# EAGLE schematic SoilCape (EAGLE 7.2.0)
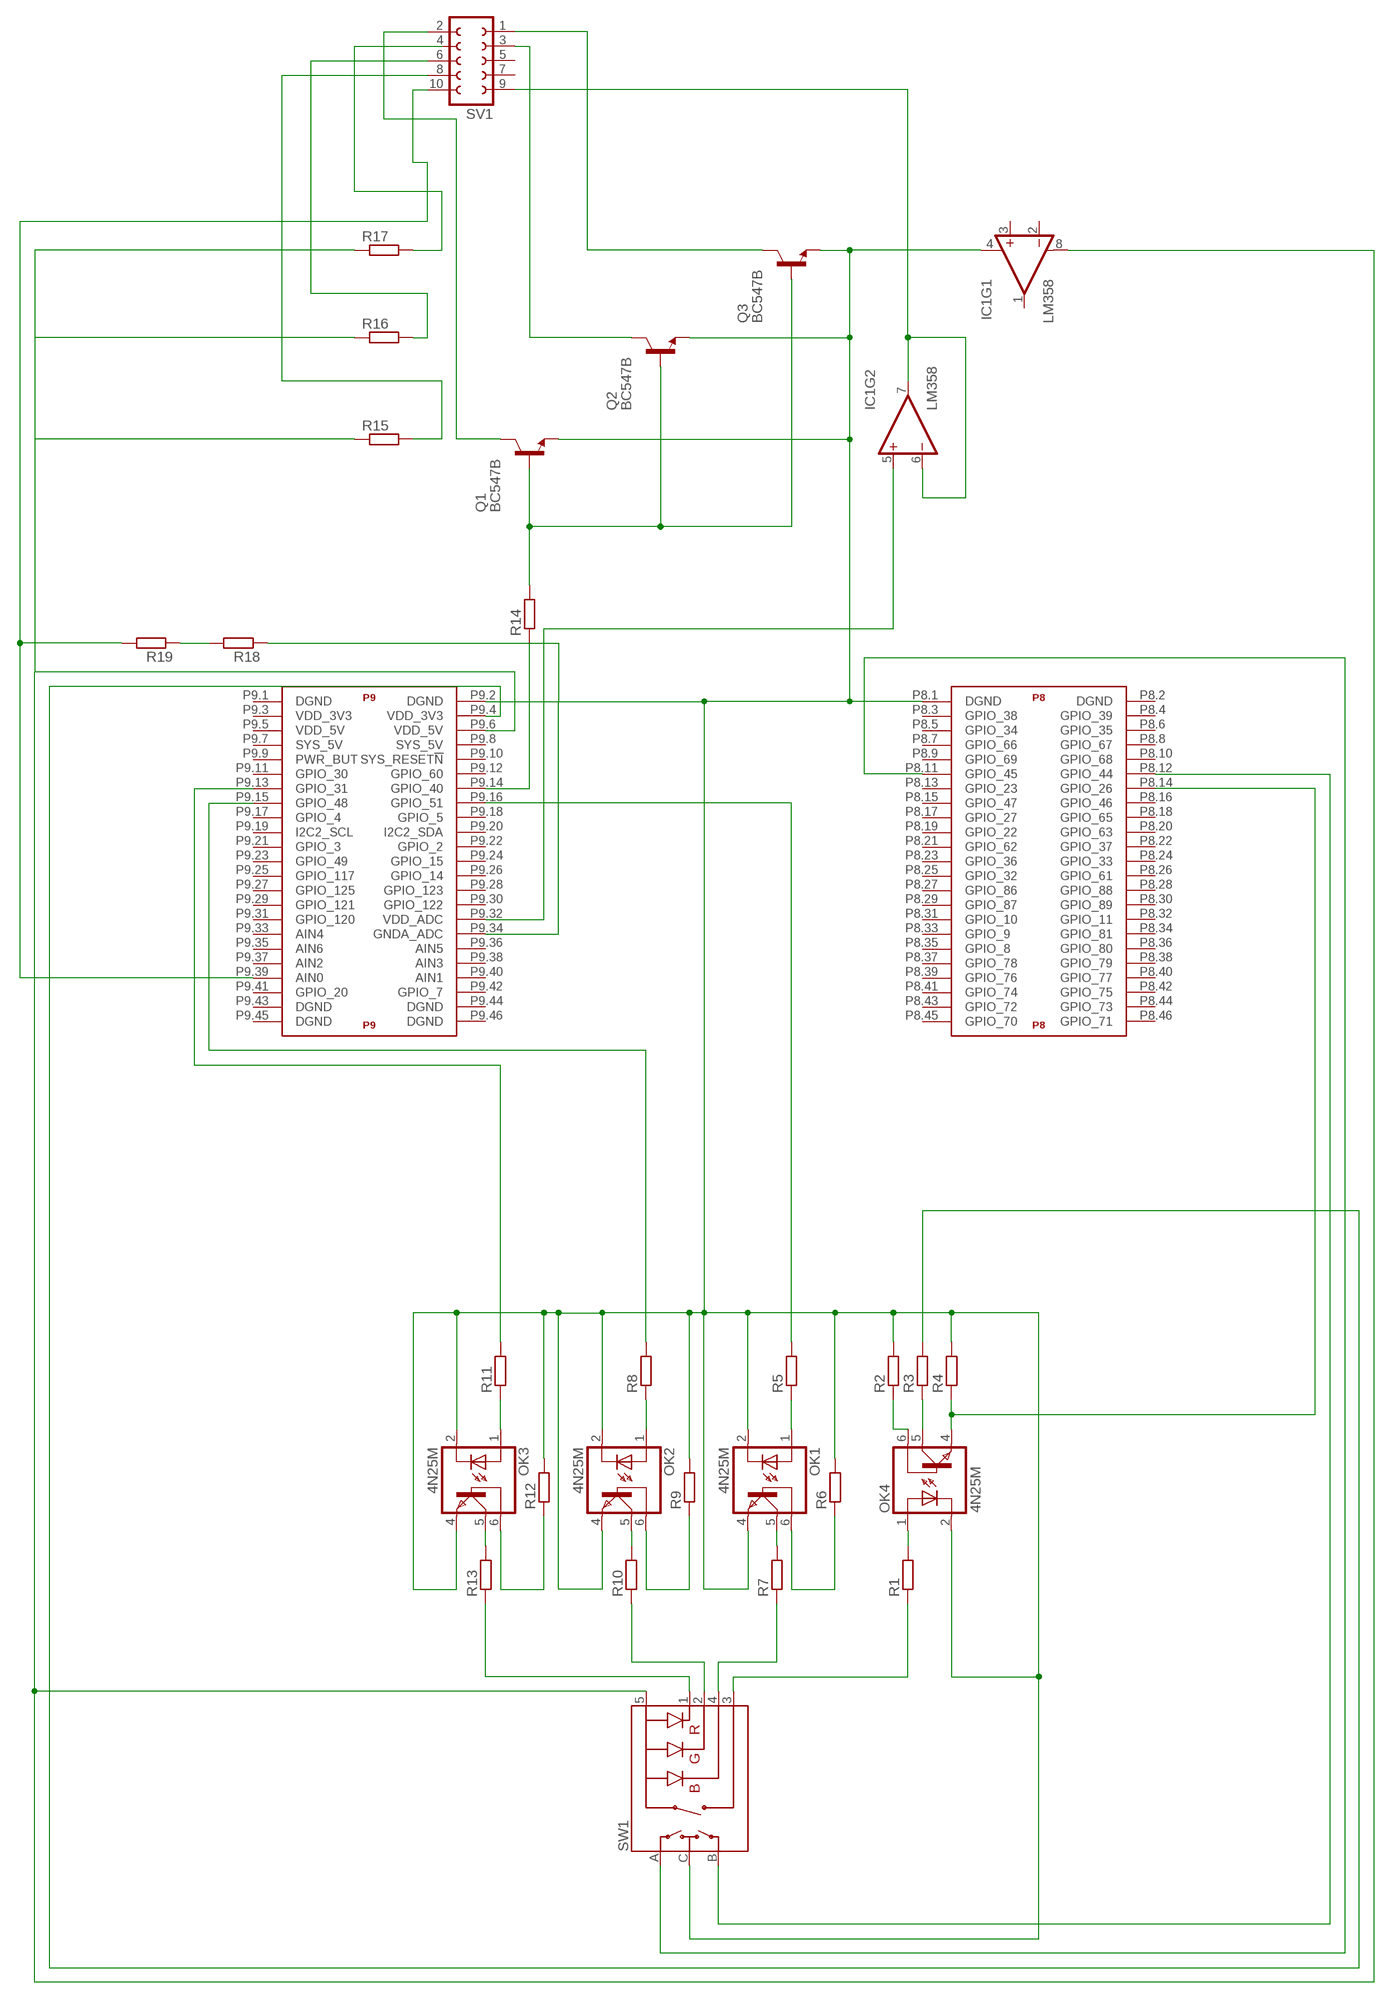
[diagram p0: schematic, sheet 1]

## Parts
IC1  LM358  [DIP08]
OK1  4N25M  [DIL06]
OK2  4N25M  [DIL06]
OK3  4N25M  [DIL06]
OK4  4N25M  [DIL06]
Q1  BC547B  [TO92]
Q2  BC547B  [TO92]
Q3  BC547B  [TO92]
R1  R-EU_0204/7  [0204/7]
R2  R-EU_0204/7  [0204/7]
R3  R-EU_0204/7  [0204/7]
R4  R-EU_0204/7  [0204/7]
R5  R-EU_0204/7  [0204/7]
R6  R-EU_0204/7  [0204/7]
R7  R-EU_0204/7  [0204/7]
R8  R-EU_0204/7  [0204/7]
R9  R-EU_0204/7  [0204/7]
R10  R-EU_0204/7  [0204/7]
R11  R-EU_0204/7  [0204/7]
R12  R-EU_0204/7  [0204/7]
R13  R-EU_0204/7  [0204/7]
R14  R-EU_0204/7  [0204/7]
R15  R-EU_0204/7  [0204/7]
R16  R-EU_0204/7  [0204/7]
R17  R-EU_0204/7  [0204/7]
R18  R-EU_0204/7  [0204/7]
R19  R-EU_0204/7  [0204/7]
SV1  FE05-2  [FE05-2]
SW1  ENCODER_RGB_CA  [ENCODER_LED_3]
U$1  BEAGLE_BONE_BLACK_CAPE  [BEAGLE_BONE_BLACK_CAPE]

## Nets
ENC_A: SW1.A U$1.P8.11(P8:GPIO_45)
ENC_B: SW1.B U$1.P8.12(P8:GPIO_44)
GND: IC1.4(V-) OK1.2(C) OK1.4(EMI) OK2.2(C) OK2.4(EMI) OK3.2(C) OK3.4(EMI) OK4.2(C) Q1.1(E) Q2.1(E) Q3.1(E) R2.2 R4.2 R6.2 R9.2 R12.2 R18.1 SW1.C U$1.P8.1(P8:DGND) U$1.P9.2(P9:DGND) U$1.P9.34(P9:GNDA_ADC)
GPIO_26: OK4.4(EMI) R4.1 U$1.P8.14(P8:GPIO_26)
GPIO_51: R5.2 U$1.P9.16(P9:GPIO_51)
N$1: OK4.5(COL) R3.1
N$2: OK4.6(BAS) R2.1
N$3: OK1.1(A) R5.1
N$4: OK3.1(A) R11.1
N$5: OK4.1(A) R1.2
N$6: R1.1 SW1.3(SW)
N$7: OK2.1(A) R8.1
N$8: OK2.5(COL) R10.2
N$9: R10.1 SW1.2(-G)
N$10: R13.1 SW1.1(-R)
N$11: OK1.6(BAS) R6.1
N$12: OK3.5(COL) R13.2
N$13: OK3.6(BAS) R12.1
N$14: R7.1 SW1.4(-B)
N$15: OK1.5(COL) R7.2
N$16: OK2.6(BAS) R9.1
N$17: IC1.8(V+) R15.1 R16.1 R17.1 SW1.5(+) U$1.P9.6(P9:VDD_5V)
N$18: R8.2 U$1.P9.15(P9:GPIO_48)
N$19: R11.2 U$1.P9.13(P9:GPIO_31)
N$20: R14.1 U$1.P9.14(P9:GPIO_40)
N$21: Q1.2(B) Q2.2(B) Q3.2(B) R14.2
N$22: Q2.3(C) SV1.3
N$23: R15.2 SV1.8
N$24: Q3.3(C) SV1.1
N$26: R16.2 SV1.6
N$28: R18.2 R19.1
N$29: IC1.6(-IN) IC1.7(OUT) SV1.9
N$30: IC1.5(+IN) U$1.P9.32(P9:VDD_ADC)
N$31: R19.2 SV1.10 U$1.P9.39(P9:AIN0)
N$36: R17.2 SV1.4
N$37: Q1.3(C) SV1.2
VDD_3V3: R3.2 U$1.P9.4(P9:VDD_3V3)
Unconnected: IC1.1(OUT) IC1.2(-IN) IC1.3(+IN) SV1.5 SV1.7 U$1.P8.2(P8:DGND) U$1.P8.3(P8:GPIO_38) U$1.P8.4(P8:GPIO_39) U$1.P8.5(P8:GPIO_34) U$1.P8.6(P8:GPIO_35) U$1.P8.7(P8:GPIO_66) U$1.P8.8(P8:GPIO_67) U$1.P8.9(P8:GPIO_69) U$1.P8.10(P8:GPIO_68) U$1.P8.13(P8:GPIO_23) U$1.P8.15(P8:GPIO_47) U$1.P8.16(P8:GPIO_46) U$1.P8.17(P8:GPIO_27) U$1.P8.18(P8:GPIO_65) U$1.P8.19(P8:GPIO_22) U$1.P8.20(P8:GPIO_63) U$1.P8.21(P8:GPIO_62) U$1.P8.22(P8:GPIO_37) U$1.P8.23(P8:GPIO_36) U$1.P8.24(P8:GPIO_33) U$1.P8.25(P8:GPIO_32) U$1.P8.26(P8:GPIO_61) U$1.P8.27(P8:GPIO_86) U$1.P8.28(P8:GPIO_88) U$1.P8.29(P8:GPIO_87) U$1.P8.30(P8:GPIO_89) U$1.P8.31(P8:GPIO_10) U$1.P8.32(P8:GPIO_11) U$1.P8.33(P8:GPIO_9) U$1.P8.34(P8:GPIO_81) U$1.P8.35(P8:GPIO_8) U$1.P8.36(P8:GPIO_80) U$1.P8.37(P8:GPIO_78) U$1.P8.38(P8:GPIO_79) U$1.P8.39(P8:GPIO_76) U$1.P8.40(P8:GPIO_77) U$1.P8.41(P8:GPIO_74) U$1.P8.42(P8:GPIO_75) U$1.P8.43(P8:GPIO_72) U$1.P8.44(P8:GPIO_73) U$1.P8.45(P8:GPIO_70) U$1.P8.46(P8:GPIO_71) U$1.P9.1(P9:DGND) U$1.P9.3(P9:VDD_3V3) U$1.P9.5(P9:VDD_5V) U$1.P9.7(P9:SYS_5V) U$1.P9.8(P9:SYS_5V) U$1.P9.9(P9:PWR_BUT) U$1.P9.10(P9:SYS_RESET!N) U$1.P9.11(P9:GPIO_30) U$1.P9.12(P9:GPIO_60) U$1.P9.17(P9:GPIO_4) U$1.P9.18(P9:GPIO_5) U$1.P9.19(P9:I2C2_SCL) U$1.P9.20(P9:I2C2_SDA) U$1.P9.21(P9:GPIO_3) U$1.P9.22(P9:GPIO_2) U$1.P9.23(P9:GPIO_49) U$1.P9.24(P9:GPIO_15) U$1.P9.25(P9:GPIO_117) U$1.P9.26(P9:GPIO_14) U$1.P9.27(P9:GPIO_125) U$1.P9.28(P9:GPIO_123) U$1.P9.29(P9:GPIO_121) U$1.P9.30(P9:GPIO_122) U$1.P9.31(P9:GPIO_120) U$1.P9.33(P9:AIN4) U$1.P9.35(P9:AIN6) U$1.P9.36(P9:AIN5) U$1.P9.37(P9:AIN2) U$1.P9.38(P9:AIN3) U$1.P9.40(P9:AIN1) U$1.P9.41(P9:GPIO_20) U$1.P9.42(P9:GPIO_7) U$1.P9.43(P9:DGND) U$1.P9.44(P9:DGND) U$1.P9.45(P9:DGND) U$1.P9.46(P9:DGND)

## Library data of the parts
IC1 = SparkFun-AnalogIC:LM358: Jellybean op-amp; PROD_ID: IC-09172
OK1-OK4 = optocoupler:4N*?M: General Purpose 6-Pin Phototransistor Optocouplers Source: http://www.fairchildsemi.com/ds/4N/4N35-M.pdf; MPN: 4N25-M; OC_FARNELL: 1021349; OC_NEWARK: 98K9084
Q1-Q3 = transistor-npn:BC547*: NPN Transistor
R1-R19 = resistor:R-EU_: RESISTOR, European symbol
SV1 = con-lsta:FE05-2: FEMALE HEADER; OC_FARNELL: unknown; OC_NEWARK: unknown
SW1 = SparkFun-Electromechanical:ENCODER_RGB_CA: Illuminated Rotary Encoder w/ RGB LED and select switch EC12PLRGBSDVBF-D: http://top-up.so-buy.com/front/bin/ptdetail.phtml?Part=EC12PLRGBSDVBF-D
U$1 = SparkFun-Boards:BEAGLE_BONE_BLACK_CAPE